# EAGLE design WiLo V1.0 (EAGLE 9.6.2)
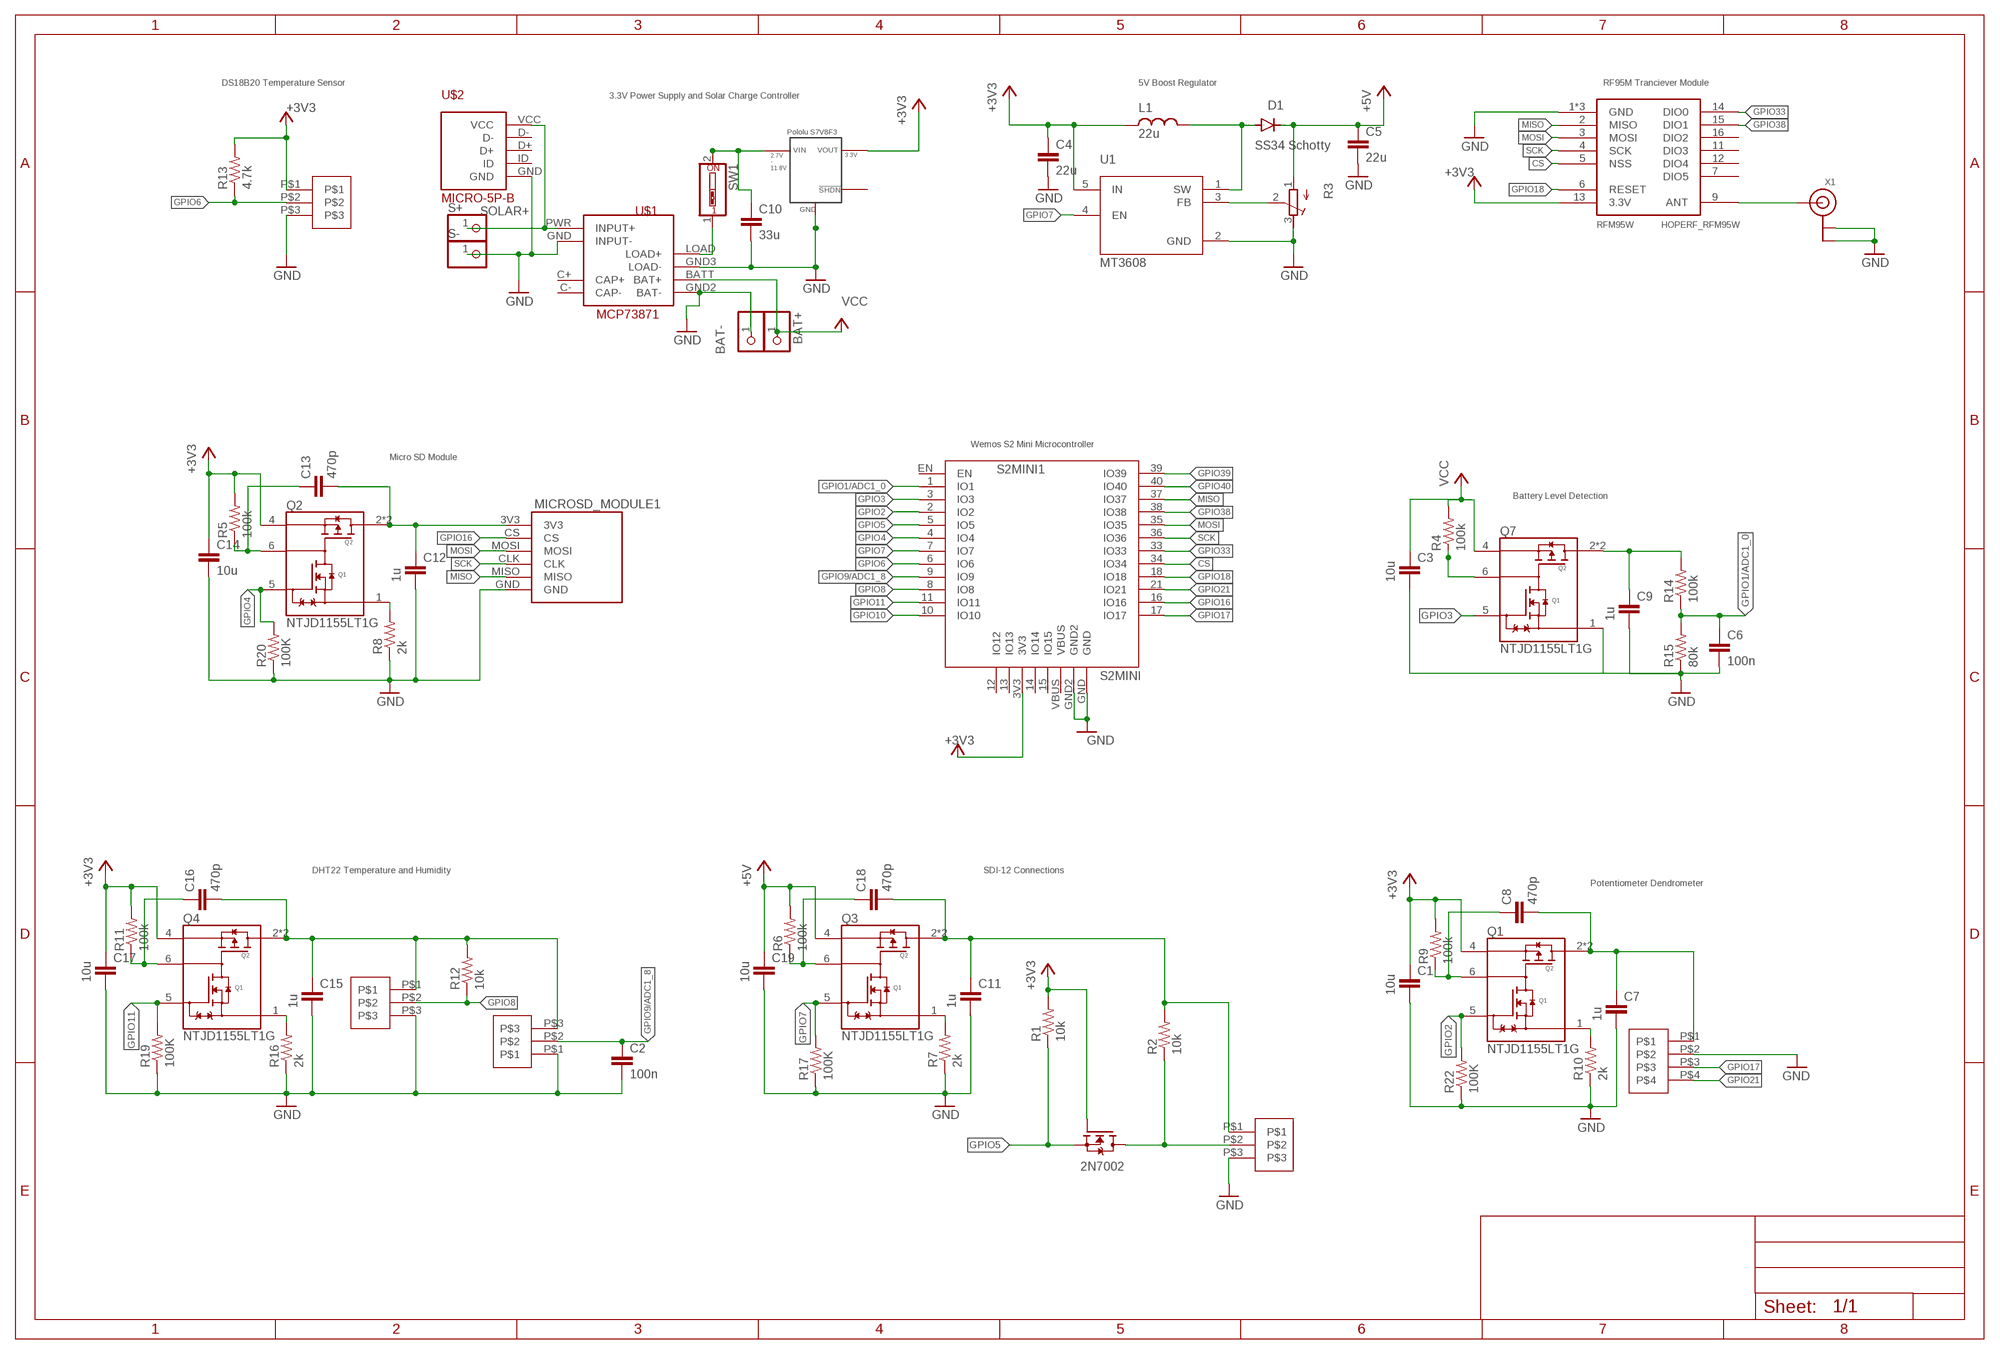
[diagram p0: schematic, sheet 1]

## Parts
BAT+  PINHD-1X1  [1X01]
BAT-  PINHD-1X1  [1X01]
C1  10u  C-EUC0805  [C0805]
C2  100n  C-EUC0805  [C0805]
C3  10u  C-EUC0805  [C0805]
C4  22u  C-EUC0805  [C0805]
C5  22u  C-EUC0805  [C0805]
C6  100n  C-EUC0805  [C0805]
C7  1u  C-EUC0805  [C0805]
C8  470p  C-EUC0805  [C0805]
C9  1u  C-EUC0805  [C0805]
C10  33u  C-EU025-024X044  [C025-024X044]
C11  1u  C-EUC0805  [C0805]
C12  1u  C-EUC0805  [C0805]
C13  470p  C-EUC0805  [C0805]
C14  10u  C-EUC0805  [C0805]
C15  1u  C-EUC0805  [C0805]
C16  470p  C-EUC0805  [C0805]
C17  10u  C-EUC0805  [C0805]
C18  470p  C-EUC0805  [C0805]
C19  10u  C-EUC0805  [C0805]
D1  SS34 Schotty  DIODE-DO214BA  [DO214BA]
L1  22u  LSLF7045  [SLF7045]
MICROSD_MODULE1  GENERIC_MICROSD_MODULE  [GENERIC_MICROSD_MODULE]
Q1  NTJD1155LT1G  [TRANS_NTJD1155LT1G]
Q2  NTJD1155LT1G  [TRANS_NTJD1155LT1G]
Q3  NTJD1155LT1G  [TRANS_NTJD1155LT1G]
Q4  NTJD1155LT1G  [TRANS_NTJD1155LT1G]
Q6  2N7002  [SOT95P240X111-3N]
Q7  NTJD1155LT1G  [TRANS_NTJD1155LT1G]
R1  10k  R-US_R0603  [R0603]
R2  10k  R-US_R0603  [R0603]
R3  R-TRIMM3296W  [RTRIM3296W]
R4  100k  R-US_R0603  [R0603]
R5  100k  R-US_R0603  [R0603]
R6  100k  R-US_R0603  [R0603]
R7  2k  R-US_R0603  [R0603]
R8  2k  R-US_R0603  [R0603]
R9  100k  R-US_R0603  [R0603]
R10  2k  R-US_R0603  [R0603]
R11  100k  R-US_R0603  [R0603]
R12  10k  R-US_R0603  [R0603]
R13  4.7k  R-US_R0603  [R0603]
R14  100k  R-US_R0603  [R0603]
R15  80k  R-US_R0603  [R0603]
R16  2k  R-US_R0603  [R0603]
R17  100K  R-US_R0603  [R0603]
R19  100K  R-US_R0603  [R0603]
R20  100K  R-US_R0603  [R0603]
R22  100K  R-US_R0603  [R0603]
RFM95W  HOPERF_RFM95W  [HOPERF_RFM95W]
S2MINI1  S2MINI  [S2MINI]
S+  PINHD-1X1  [1X01]
S-  PINHD-1X1  [1X01]
SW1  SW_DIP-1  [EDG-01]
U1  MT3608  [SOT95P280X145-6N]
U$1  MCP73871  [MCP73871]
U$2  MICRO-5P-B  [MICRO-5P-B]
U$3  S7V8F3  [S7V8F3]
U$4  3PIN_2.54_SCREW  [3PIN_2.54_SCREW]
U$5  3PIN_2.54_SCREW  [3PIN_2.54_SCREW]
U$6  3PIN_2.54_SCREW  [3PIN_2.54_SCREW]
U$7  3PIN_2.54_SCREW  [3PIN_2.54_SCREW]
U$8  4PIN_2.54_SCREW  [4PIN_2.54_SCREW]
X1  ANTENNA_U.FL  [U.FL]

## Nets
5V_SDI12: C11.1 C18.2 Q3.2(D2) Q3.3(D2) R2.2 U$7.P$1
+3V3: C1.1 C4.1 C14.1 C17.1 L1.+ Q1.4(S2) Q2.4(S2) Q4.4(S2) Q6.1(G) R1.2 R5.2 R9.2 R11.2 R13.2 RFM95W.13(3.3V) S2MINI1.3V3 U1.5(IN) U$3.VOUT U$4.P$1
+5V: C5.1 C19.1 D1.C Q3.4(S2) R3.1(A) R6.2
CS [Impedance]: RFM95W.5(NSS) S2MINI1.34(IO34)
GND: BAT-.1 C1.2 C2.2 C3.2 C4.2 C5.2 C6.2 C7.2 C9.2 C10.2 C11.2 C12.2 C14.2 C15.2 C17.2 C19.2 MICROSD_MODULE1.GND Q7.1(S1) R3.3(E) R7.1 R8.1 R10.1 R15.1 R16.1 R17.1 R19.1 R20.1 R22.1 RFM95W.1(GND) RFM95W.8(GND) RFM95W.10(GND) S2MINI1.GND S2MINI1.GND2 S-.1 U1.2(GND) U$1.GND2(BAT-) U$1.GND3(LOAD-) U$1.GND(INPUT-) U$2.GND U$3.GND U$4.P$3 U$5.P$3 U$6.P$1 U$7.P$3 U$8.P$2 X1.1(GND) X1.2(GND)
GPIO1/ADC1_0 [vcc]: C6.1 R14.1 R15.2 S2MINI1.1(IO1)
GPIO2 [vcc]: Q1.5(G1) R22.2 S2MINI1.2(IO2)
GPIO3 [vcc]: Q7.5(G1) S2MINI1.3(IO3)
GPIO4 [vcc]: Q2.5(G1) R20.2 S2MINI1.4(IO4)
GPIO5 [vcc]: Q6.2(S) R1.1 S2MINI1.5(IO5)
GPIO6 [vcc]: R13.1 S2MINI1.6(IO6) U$4.P$2
GPIO7 [vcc]: Q3.5(G1) R17.2 S2MINI1.7(IO7) U1.4(EN)
GPIO8 [vcc]: R12.1 S2MINI1.8(IO8) U$5.P$2
GPIO9/ADC1_8 [vcc]: C2.1 S2MINI1.9(IO9) U$6.P$2
GPIO10 [vcc]: S2MINI1.10(IO10)
GPIO11 [vcc]: Q4.5(G1) R19.2 S2MINI1.11(IO11)
GPIO16 [vcc]: MICROSD_MODULE1.CS S2MINI1.16(IO16)
GPIO17 [vcc]: S2MINI1.17(IO17) U$8.P$3
GPIO18 [vcc]: RFM95W.6(RESET) S2MINI1.18(IO18)
GPIO21 [vcc]: S2MINI1.21(IO21) U$8.P$4
GPIO33 [vcc]: RFM95W.14(DIO0) S2MINI1.33(IO33)
GPIO38: RFM95W.15(DIO1) S2MINI1.38(IO38)
GPIO39 [vcc]: S2MINI1.39(IO39)
GPIO40: S2MINI1.40(IO40)
MISO [vcc]: MICROSD_MODULE1.MISO RFM95W.2(MISO) S2MINI1.37(IO37)
MOSI [vcc]: MICROSD_MODULE1.MOSI RFM95W.3(MOSI) S2MINI1.35(IO35)
N$1 [Impedance]: RFM95W.9(ANT) X1.3(SIGNAL)
N$2: C18.1 Q3.6(D1/G2) R6.1
N$4: Q3.1(S1) R7.2
N$5: C8.1 Q1.6(D1/G2) R9.1
N$6: C7.1 C8.2 Q1.2(D2) Q1.3(D2) U$8.P$1
N$7: Q1.1(S1) R10.2
N$9: D1.A L1.- U1.1(SW)
N$12: C10.1 SW1.2 U$3.VIN
N$13: C9.1 Q7.2(D2) Q7.3(D2) R14.2
N$14: R3.2(S) U1.3(FB)
N$15: C13.1 Q2.6(D1/G2) R5.1
N$16: C12.1 C13.2 MICROSD_MODULE1.3V3 Q2.2(D2) Q2.3(D2)
N$17: Q2.1(S1) R8.2
N$18: Q7.6(D1/G2) R4.1
N$19: C16.1 Q4.6(D1/G2) R11.1
N$21: C15.1 C16.2 Q4.2(D2) Q4.3(D2) R12.2 U$5.P$1 U$6.P$3
N$22: Q4.1(S1) R16.2
N$24: Q6.3(D) R2.1 U$7.P$2
N$130: SW1.1 U$1.LOAD(LOAD+)
SCK [vcc]: MICROSD_MODULE1.CLK RFM95W.4(SCK) S2MINI1.36(IO36)
SOLAR+ [vcc]: S+.1 U$1.PWR(INPUT+) U$2.VCC
VCC [vcc]: BAT+.1 C3.1 Q7.4(S2) R4.2 U$1.BATT(BAT+)
Unconnected: RFM95W.7(DIO5) RFM95W.11(DIO3) RFM95W.12(DIO4) RFM95W.16(DIO2) S2MINI1.12(IO12) S2MINI1.13(IO13) S2MINI1.14(IO14) S2MINI1.15(IO15) S2MINI1.EN S2MINI1.VBUS U$1.C+(CAP+) U$1.C-(CAP-) U$2.D+ U$2.D- U$2.ID U$3.!SHDN

## Notes on the sheet
- DS18B20 Temperature Sensor | 5V Boost Regulator | RF95M Tranciever Module
- 3.3V Power Supply and Solar Charge Controller
- Wemos S2 Mini Microcontroller
- Micro SD Module
- Battery Level Detection
- DHT22 Temperature and Humidity | SDI-12 Connections
- Potentiometer Dendrometer

## Library data of the parts
BAT+ BAT- S+ S- = pinhead:PINHD-1X1: PIN HEADER
C1-C19 = rcl:C-EU: CAPACITOR, European symbol; SPICEPREFIX: C
D1 = diode:DIODE-: DIODE
L1 = ELL6UH220:L: INDUCTOR
MICROSD_MODULE1 = GENERIC_MICROSD_MODULE:GENERIC_MICROSD_MODULE
Q1-Q4 Q7 = NTJD1155LT1G:NTJD1155LT1G: Mosfet Array N and P-Channel 8V 1.3A 400mW Surface Mount SC-88/SC70-6/SOT-363 Check availability <https://pricing.snapeda.com/parts/NTJD1155LT1G/ON%20Semiconductor/view-part?ref=eda>; AVAILABILITY: In Stock; CHECK_PRICES: https://www.snapeda.com/parts/NTJD1155LT1G/Onsemi/view-part/?ref=eda; DESCRIPTION: Mosfet Array N and P-Channel 8V 1.3A 400mW Surface Mount SC-88/SC70-6/SOT-363; MF: ON Semiconductor; MP: NTJD1155LT1G; PACKAGE: SC-88-6 ON Semiconductor; PRICE: None; SNAPEDA_LINK: https://www.snapeda.com/parts/NTJD1155LT1G/Onsemi/view-part/?ref=snap
Q6 = 2N7002:2N7002: N-Channel 60V 280mA (Ta) 350mW (Ta) Surface Mount SOT-23-3 (TO-236) Check availability <https://pricing.snapeda.com/parts/2N7002/ON%20Semiconductor/view-part?ref=eda>; AVAILABILITY: In Stock; CHECK_PRICES: https://www.snapeda.com/parts/2N7002/Onsemi/view-part/?ref=eda; DESCRIPTION: Mosfet Array 2 N-Channel (Dual) 60V 280mA 250mW Surface Mount SOT-563F; MF: ON Semiconductor; MP: 2N7002; PACKAGE: SOT-23-3 ON Semiconductor; PRICE: None; SNAPEDA_LINK: https://www.snapeda.com/parts/2N7002/Onsemi/view-part/?ref=snap
R1 R2 R4-R17 R19 R20 R22 = rcl:R-US_: RESISTOR, American symbol; SPICEPREFIX: R
R3 = rcl:R-TRIMM: Trimm resistor; SPICEMODEL: X; SPICEPREFIXL: POT
RFM95W = lora-lorawan-modules:HOPERF_RFM95W: HopeRF LoRaWAN modules Link: http://www.hoperf.com/rf_transceiver/lora/; HEIGHT: 1.8; LENGTH: 16; WIDTH: 16
S2MINI1 = S2MINI:S2MINI
SW1 = special:SW_DIP-1: DIP SWITCH
U1 = MT3608:MT3608: High Efficiency 1.2MHz 2A Step Up Converter Check availability <https://pricing.snapeda.com/parts/MT3608/Aerosemi%20Technology%20Co.%2C%20Ltd/view-part?ref=eda>; AVAILABILITY: Not in stock; CHECK_PRICES: https://www.snapeda.com/parts/MT3608/Aerosemi+Technology+Co.%252C+Ltd/view-part/?ref=eda; DESCRIPTION: High Efficiency 1.2MHz 2A Step Up Converter; MF: Aerosemi Technology Co., Ltd; MP: MT3608; PACKAGE: Package; PRICE: None; SNAPEDA_LINK: https://www.snapeda.com/parts/MT3608/Aerosemi+Technology+Co.%252C+Ltd/view-part/?ref=snap
U$1 = MCP73871 Solar Battery Charging Board:MCP73871
U$2 = MICRO-5P-B:MICRO-5P-B
U$3 = Pololu_S7V8F3:S7V8F3: Pololu S7V8F3 - Pololu 3.3V Step-Up/Step-Down Voltage Regulator S7V8F3 - The S7V8F3 switching step-up/step-down regulator efficiently produces a fixed 3.3 V output from input voltages between 2.7 V and 11.8 V. Its ability to convert both higher and lower input voltages makes it useful for applications where the power supply voltage can vary greatly, as with batteries that start above but discharge below the regulated voltage. The compact module has a typical efficiency of over 90% and can deliver 500 mA to 1 A across most of the input voltage range.
U$4-U$7 = 3-PIN_2.54_SCREW:3PIN_2.54_SCREW
U$8 = 4-PIN_2.54_SCREW:4PIN_2.54_SCREW
X1 = adafruit:ANTENNA_U.FL: U.FL Antenna Connector

## Net classes
0 default: width 0.203 mm
1 vcc: width 0.254 mm
2 Impedance: clearance 0.254 mm

## Board
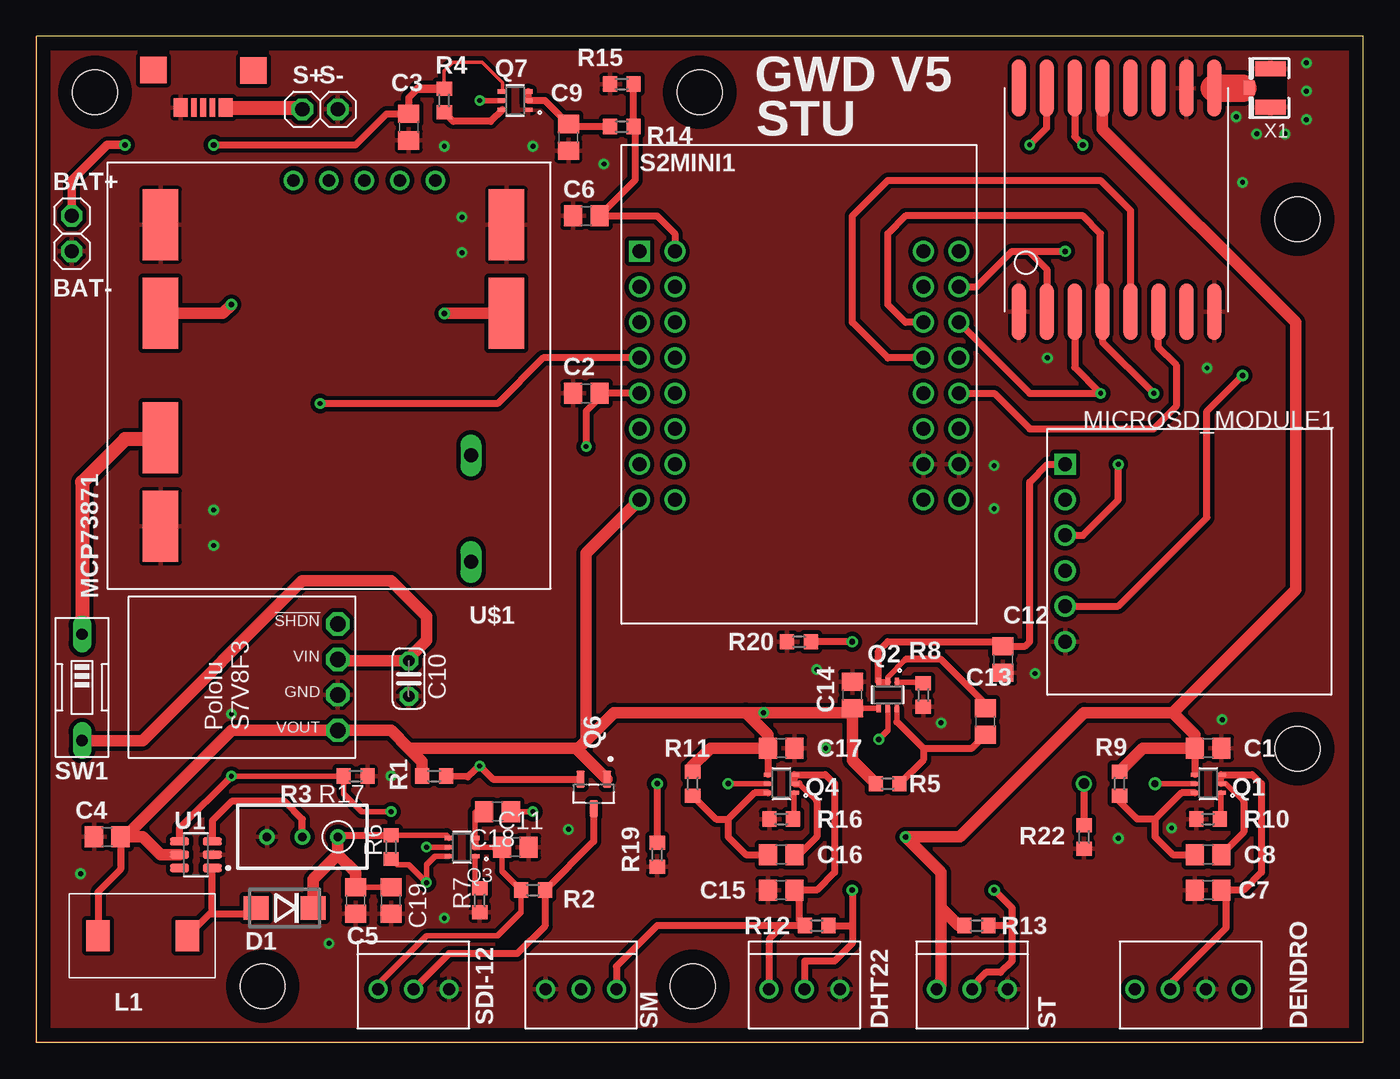
[diagram p1: board, top side]
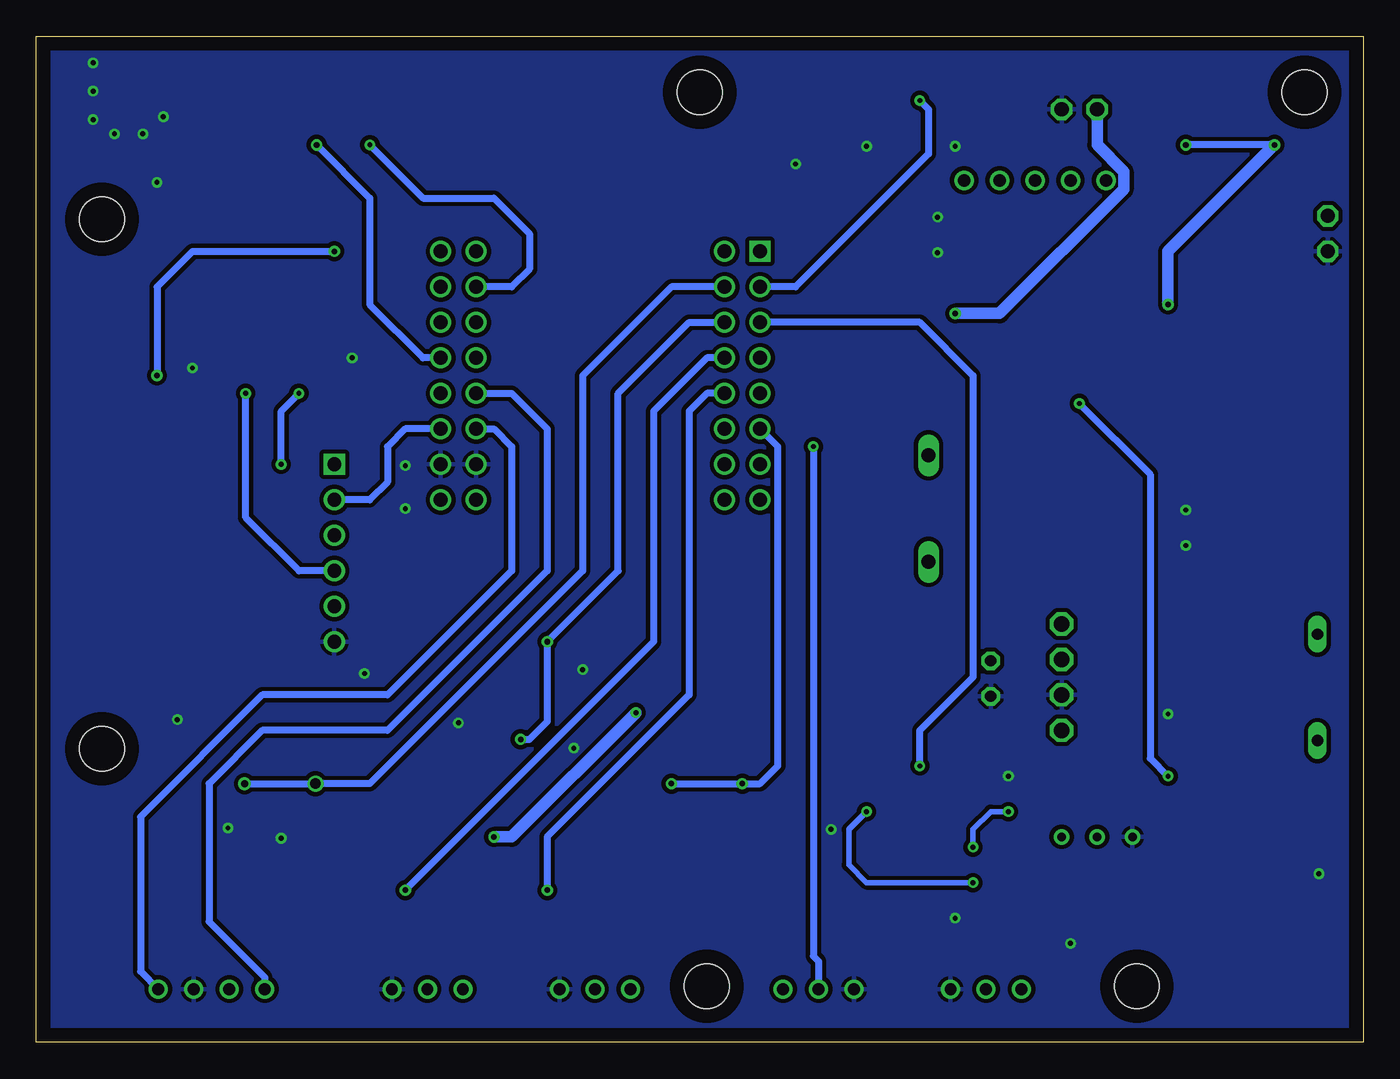
[diagram p2: board, bottom side, seen from below]

Size 95 x 72 mm. Coordinates in mm from the lower left corner, seen from the top.
Outline: 0,0 95,0 95,72 0,72 0,0
Copper layers (1*16): Top 0.035mm / dielectric 1.5mm / Bottom 0.035mm
Design rules "default": minimum track width 6mil, minimum drill 0.35mm, track to track 6mil, track to pad 6mil, pad to pad 6mil, via to via 6mil, smd to smd 6mil, copper to edge 40mil, drill to drill 6mil, minimum pad ring 10mil, minimum via ring 8mil, stop-mask expansion 4mil, vias tented up to drill 0mil, thermal gap 10mil
Holes 3.2 mm at 47,4 47.5,68 90.3,58.9 4.2,68 90.3,21 16.2,4
tKeepout: area 45.3,2.3 to 48.7,5.7; area 45.8,66.3 to 49.2,69.7; area 88.6,57.2 to 92,60.6; area 2.5,66.3 to 5.9,69.7; area 88.6,19.3 to 92,22.7; area 14.5,2.3 to 17.9,5.7
bKeepout: area 45.3,2.3 to 48.7,5.7; area 45.3,2.3 to 48.7,5.7; area 45.8,66.3 to 49.2,69.7; area 45.8,66.3 to 49.2,69.7; area 88.6,57.2 to 92,60.6; area 88.6,57.2 to 92,60.6; area 2.5,66.3 to 5.9,69.7; area 2.5,66.3 to 5.9,69.7; area 88.6,19.3 to 92,22.7; area 88.6,19.3 to 92,22.7; area 14.5,2.3 to 17.9,5.7; area 14.5,2.3 to 17.9,5.7
tRestrict: area 45.3,2.3 to 48.7,5.7; area 45.8,66.3 to 49.2,69.7; area 88.6,57.2 to 92,60.6; area 2.5,66.3 to 5.9,69.7; area 88.6,19.3 to 92,22.7; area 14.5,2.3 to 17.9,5.7
vRestrict: area 45.3,2.3 to 48.7,5.7; area 45.8,66.3 to 49.2,69.7; area 88.6,57.2 to 92,60.6; area 2.5,66.3 to 5.9,69.7; area 88.6,19.3 to 92,22.7; area 14.5,2.3 to 17.9,5.7

### Footprints (pad centres in the part's own frame; a part is rotated, then mirrored left to right if it is on the bottom)
1X01 = drill 1.016 octagon: 1 0,0
C0805 = smd 1.3 x 1.5: 1 -0.95,0; 2 0.95,0
C025-024X044 = drill 0.813 octagon: 1 -1.27,0; 2 1.27,0
DO214BA = smd 1.8 x 1.7: A 2.05,0; C -2.05,0
SLF7045 = smd 1.7 x 2.2: + -3.2,0; - 3.2,0
GENERIC_MICROSD_MODULE = drill 1 square: 3V3 1.27,-2.54 | drill 1: CLK 1.27,-10.16; CS 1.27,-5.08; GND 1.27,-15.24; MISO 1.27,-12.7; MOSI 1.27,-7.62
TRANS_NTJD1155LT1G = smd 0.66 x 0.3: 1 -0.92,0.65; 2 -0.92,0; 3 -0.92,-0.65; 4 0.92,-0.65; 5 0.92,0; 6 0.92,0.65
SOT95P240X111-3N = smd 1.23 x 0.6: 1 -1.06,0.95; 2 -1.06,-0.95; 3 1.06,0
R0603 = smd 1 x 1.1: 1 -0.85,0; 2 0.85,0
RTRIM3296W = drill 0.61: 1 0,-2.54; 2 0,0; 3 0,2.54
HOPERF_RFM95W = smd 4.064 x 1.016: 1 -8.12,7.13; 2 -8.12,5.13; 3 -8.12,3.13; 4 -8.12,1.13; 5 -8.12,-0.87; 6 -8.12,-2.87; 7 -8.12,-4.87; 8 -8.12,-6.87; 9 7.88,-6.87; 10 7.88,-4.87; 11 7.88,-2.87; 12 7.88,-0.87; 13 7.88,1.13; 14 7.88,3.13; 15 7.88,5.13; 16 7.88,7.13
S2MINI = drill 1: 1 3.81,-7.62; 2 3.81,-10.16; 3 1.27,-10.16; 3V3 1.27,-25.4; 4 3.81,-12.7; 5 1.27,-12.7; 6 3.81,-15.24; 7 1.27,-15.24; 8 3.81,-17.78; 9 1.27,-17.78; 10 3.81,-20.32; 11 1.27,-20.32; 12 1.27,-22.86; 13 3.81,-22.86; 14 3.81,-25.4; 15 21.59,-25.4; 16 24.13,-20.32; 17 21.59,-20.32; 18 24.13,-17.78; 21 21.59,-17.78; 33 24.13,-15.24; 34 21.59,-15.24; 35 24.13,-12.7; 36 21.59,-12.7; 37 24.13,-10.16; 38 21.59,-10.16; 39 24.13,-7.62; 40 21.59,-7.62; GND 21.59,-22.86; GND2 24.13,-22.86; VBUS 24.13,-25.4 | drill 1 square: EN 1.27,-7.62
EDG-01 = drill 0.813 long: 1 0,-3.81; 2 0,3.81
SOT95P280X145-6N = smd 1.37 x 0.59: 1 -1.17,0.95; 2 -1.17,0; 3 -1.17,-0.95; 4 1.17,-0.95; 5 1.17,0; 6 1.17,0.95
MCP73871 = drill 0.9: + 8.255,1.27; +2 15.875,1.27; - 10.795,1.27; C 18.415,1.27; D 13.335,1.27 | smd 2.54 x 5.08: BATT 27.94,10.795; GND 3.175,4.445; GND2 27.94,4.445; GND3 27.94,26.035; LOAD 27.94,19.685; PWR 3.175,10.795 | drill 1 long: C+ 5.715,20.955; C- 5.715,28.575
MICRO-5P-B = smd 0.4 x 1.35: D+ 0,2.7; D- -0.65,2.7; ID 0.65,2.7 | smd 1 x 1.35: GND 1.6,2.7; VCC -1.6,2.7 | smd 1.9 x 1.9: P$1 3.55,0; P$8 -3.6,0.05
S7V8F3 = drill 1.1 octagon: !SHDN 3.81,0; GND -1.27,0; VIN 1.27,0; VOUT -3.81,0
3PIN_2.54_SCREW = drill 0.85: P$1 2.8,6.54; P$2 2.8,4; P$3 2.8,1.46
4PIN_2.54_SCREW = drill 0.85: P$1 2.8,6.54; P$2 2.8,4; P$3 2.8,1.46; P$4 2.8,9.08
U.FL = smd 2.2 x 1.05: 1 0,1.375; 2 0,-1.375 | smd 0.8 x 1: 3 1.525,0

### Placement (x,y rotation side)
BAT+  2.54,59.15 0 top
BAT-  2.54,56.61 0 top
C1  83.9,21.05 0 top
C2  39.37,46.45 180 top
C3  26.67,65.5 270 top
C4  5.08,14.7 180 top
C5  22.86,10.16 270 top
C6  39.37,59.15 180 top
C7  83.9,10.89 180 top
C8  83.9,13.43 0 top
C9  38.1,64.77 270 top
C10  26.67,26.04 270 top
C11  34.29,13.97 0 top
C12  69.22,27.4 270 top
C13  67.94,22.95 90 top
C14  58.42,24.86 90 top
C15  53.34,10.89 180 top
C16  53.34,13.43 0 top
C17  53.34,21.05 0 top
C18  33.02,16.51 180 top
C19  25.4,10.16 270 top
D1  17.78,9.62 180 top
L1  7.62,7.62 0 top
MICROSD_MODULE1  72.39,43.91 0 top
Q1  83.9,18.51 180 top
Q2  60.96,24.86 270 top
Q3  30.48,13.97 180 top
Q4  53.34,18.51 180 top
Q6  39.91,17.78 270 top
Q7  34.29,67.41 180 top
R1  28.48,19.05 180 top
R2  35.56,10.89 180 top
R3  19.05,14.7 90 top
R4  29.21,67.41 90 top
R5  60.96,18.51 180 top
R6  25.4,13.97 90 top
R7  31.75,10.16 90 top
R8  63.5,24.86 90 top
R9  77.55,18.51 90 top
R10  83.9,15.97 0 top
R11  46.99,18.51 90 top
R12  55.88,8.35 180 top
R13  67.31,8.35 180 top
R14  41.91,65.54 180 top
R15  41.91,68.58 0 top
R16  53.34,15.97 0 top
R17  22.86,19.05 180 top
R19  44.45,13.43 90 top
R20  54.61,28.67 0 top
R22  75.01,14.7 90 top
RFM95W  77.47,60.42 90 top
S2MINI1  41.91,64.23 0 top
S+  19.05,66.77 0 top
S-  21.59,66.77 0 top
SW1  3.27,25.4 180 top
U1  11.43,13.43 180 top
U$1  36.83,62.96 180 top
U$2  11.95,69.6 180 top
U$3  21.59,26.13 90 top
U$4  71,1 90 top
U$5  59,1 90 top
U$6  43,1 90 top
U$7  31,1 90 top
U$8  87.73,1 90 top
X1  88.37,68.3 180 top

### Tracks (layer width: path | path; a pad name or v marks a point on that pad's centre or on a via)
5V_SDI12
  Top 0.406: Q3.3 31.4,16.48 C18.2 | Q3.2 C11.1 33.34,12.26 R2.2 34.71,9.31 33.02,7.62 27.94,7.62 24.46,4.14 U$7.P$1
  Top 0.508: Q3.3 Q3.2
+3V3  (via drill 0.35, 0.4)
  Top 0.406: C14.1 60.28,23.91 Q2.4
  Top 0.508: C1.1 82.95,19.19 Q1.4 | Q4.4 52.42,21.02 C17.1 | C4.1 6.03,12.38 4.42,10.77 L1.+
  Top 0.813: S2MINI1.3V3 39.37,35.02 39.37,21.59 | U1.5 8.89,13.43 7.62,14.7 C4.1 6.35,14.7 13.97,22.32 U$3.VOUT 25.4,22.32 26.67,21.05 | R11.2 46.89,19.46 46.89,19.68 48.26,21.05 C17.1 52.39,22 50.8,23.59 | R9.2 79.24,21.05 C1.1 82.95,22 81.36,23.59 | R5.2 58.42,20.2 C14.1 58.1,23.59 v52.07,23.59 50.8,23.59 | 81.36,23.59 75.01,23.59 66.12,14.7 v62.23,14.7 64.77,12.16 64.77,9.62 | 81.36,23.59 90.17,32.4 90.17,51.53 76.34,65.36 RFM95W.13 | 64.77,9.62 66.04,8.35 R13.2 | U$4.P$1 64.77,4.11 64.77,9.62 | 26.67,21.05 38.64,21.05 | Q6.1 38.64,21.05 | 38.64,21.05 38.83,21.05 39.37,21.59 | 50.8,23.59 41.37,23.59 39.37,21.59 | 26.67,21.05 27.63,20.09 R1.2
  Bottom 0.813: v62.23,14.7 60.96,14.7 v52.07,23.59
+5V
  Top 0.406: R6.2 29.36,14.82 Q3.4 | C5.1 C19.1
  Top 0.508: R3.1 21.71,14.82 R6.2
  Top 0.813: R3.1 21.59,13.43 | D1.C 19.83,11.67 21.59,13.43 | 21.59,13.43 22.86,12.16 C5.1
CS
  Top 0.508: S2MINI1.34 60.96,48.99 58.42,51.53 58.42,59.15 60.96,61.69 76.2,61.69 78.34,59.55 RFM95W.5
GND  (via drill 0.35)
  other vias: 81.28,15.34 56.52,21.05 20.95,7.08 68.58,38.2 72.39,48.99 90.93,66.04 86.37,61.55 90.93,70.1 90.93,68.07 85.91,66.25 87.38,65.02 89.41,65.02 84.9,23.1 64.77,22.86 55.88,26.67 3.17,12.06 71.5,26.4 77.47,14.61 68.58,41.27 12.7,38.1 12.7,35.56 30.48,59.05 29.21,64.14 35.56,64.14 40.64,62.87 30.48,56.52 13.97,23.5 83.82,48.26 38.1,15.24 29.21,8.89 25.4,19.05
  pour Top (isolate 0.305): 0,72 95,72 95,0 0,0
  pour Bottom (isolate 0.305): 0,72 95,72 95,0 0,0
GPIO1/ADC1_0
  Top 0.508: R15.2 R14.1 42.86,65.44 42.86,61.69 C6.1 44.45,59.15 45.72,57.88 S2MINI1.1
GPIO2  (via drill 0.5, 0.75)
  Top 0.406: Q1.5 v80.09,18.51
  Top 0.508: v75.01,18.51 R22.2
  Bottom 0.508: v80.09,18.51 v75.01,18.51 71.12,18.51 55.88,33.75 55.88,47.72 49.53,54.07 S2MINI1.2
GPIO3  (via drill 0.35)
  Top 0.406: Q7.5 v31.75,67.41
  Bottom 0.508: v31.75,67.41 31.11,66.77 31.11,63.59 40.64,54.07 S2MINI1.3
GPIO4  (via drill 0.4)
  Top 0.406: Q2.5 60.96,22.32 v60.33,21.68
  Top 0.508: v58.42,28.67 R20.2
  Bottom 0.508: v60.33,21.68 59.69,21.68 58.42,22.95 v58.42,28.67 53.34,33.75 53.34,46.45 48.26,51.53 S2MINI1.4
GPIO5  (via drill 0.35)
  Top 0.508: R1.1 30.88,19 v31.75,19.78 32.69,18.84 Q6.2
  Bottom 0.508: v31.75,19.78 31.75,22.32 27.94,26.13 27.94,47.72 31.75,51.53 S2MINI1.5
GPIO6  (via drill 0.4)
  Top 0.508: v68.58,10.89 69.85,9.62 69.85,8.35 | 69.85,8.35 69.85,5.81 69.04,5 68,5 66.9,3.9 U$4.P$2 | 69.85,8.35 R13.1
  Bottom 0.508: S2MINI1.6 46.99,48.99 50.8,45.18 50.8,28.67 v68.58,10.89
GPIO7  (via drill 0.35)
  Top 0.406: v13.97,19.05 R17.2 22.01,17.78 23.28,16.51 v25.4,16.51 | v27.94,13.97 Q3.5
  Top 0.508: U1.4 10.26,15.34 v13.97,19.05 | S2MINI1.7 36.29,48.99 33.02,45.72 v20.32,45.72
  Bottom 0.406: v25.4,16.51 26.67,16.51 27.94,15.24 v27.94,13.97
  Bottom 0.508: v20.32,45.72 15.24,40.64 15.24,20.32 v13.97,19.05
GPIO8  (via drill 0.4)
  Top 0.508: 58.42,8.35 58.42,7.08 57.15,5.81 55,5.81 U$5.P$2 | R12.1 58.42,8.35 | v58.42,10.89 58.42,8.35
  Bottom 0.508: S2MINI1.8 46.99,46.45 48.26,45.18 48.26,24.86 58.42,14.7 v58.42,10.89
GPIO9/ADC1_8  (via drill 0.35)
  Top 0.508: S2MINI1.9 C2.1 40.32,46.13 39.37,45.18 v39.37,42.64
  Bottom 0.508: v39.37,42.64 39.37,6.17 39,5.8 U$6.P$2
GPIO11  (via drill 0.4)
  Top 0.406: Q4.5 v49.53,18.51
  Top 0.508: v44.45,18.51 R19.2
  Bottom 0.508: S2MINI1.11 41.91,42.64 41.91,19.78 43.18,18.51 v44.45,18.51 v49.53,18.51
GPIO16
  Bottom 0.508: S2MINI1.16 68.58,43.91 69.85,42.64 69.85,40.1 71.12,38.83 MICROSD_MODULE1.CS
GPIO17
  Bottom 0.508: S2MINI1.17 62.23,43.91 60.96,42.64 60.96,33.75 69.85,24.86 78.82,24.86 87.54,16.14 87.54,5.07 U$8.P$3
GPIO18
  Top 0.508: S2MINI1.18 68.58,46.45 71.12,43.91 80.01,43.91 81.61,45.51 81.61,48.49 80.34,49.76 RFM95W.6
GPIO21
  Bottom 0.508: S2MINI1.21 60.96,46.45 58.42,43.91 58.42,33.75 69.85,22.32 78.82,22.32 82.63,18.51 82.63,8.63 78.65,4.65 U$8.P$4
GPIO33  (via drill 0.4)
  Top 0.508: v74.93,64.23 74.34,64.82 RFM95W.14
  Bottom 0.508: v74.93,64.23 71.12,60.42 71.12,52.8 67.31,48.99 S2MINI1.33
GPIO38  (via drill 0.35)
  Top 0.508: RFM95W.15 72.34,65.45 v71.12,64.23
  Bottom 0.508: v71.12,64.23 67.31,60.42 62.23,60.42 59.69,57.88 59.69,55.34 60.96,54.07 S2MINI1.38
MISO  (via drill 0.4)
  Top 0.508: 71.07,56.61 72.34,55.34 RFM95W.2 | S2MINI1.37 67.31,54.07 69.85,56.61 71.07,56.61 | MICROSD_MODULE1.MISO 77.47,31.21 83.82,37.56 83.82,45.18 v86.36,47.72 | 71.07,56.61 v73.66,56.61
  Bottom 0.508: v86.36,47.72 86.36,54.07 83.82,56.61 v73.66,56.61
MOSI  (via drill 0.35)
  Top 0.508: S2MINI1.35 71.12,46.45 v76.2,46.45 74.34,48.31 RFM95W.3 | MICROSD_MODULE1.MOSI 74.93,36.29 77.47,38.83 v77.47,41.37
  Bottom 0.508: v77.47,41.37 77.47,45.18 v76.2,46.45
N$1
  Top 0.508: X1.3 86.37,68.3
  Top 1.956: 86.37,68.3 RFM95W.9
N$2  (via drill 0.35)
  Top 0.406: C18.1 v35.56,16.51 | R6.1 25.82,12.7 26.67,12.7 v27.94,11.43 27.94,12.7 28.56,13.32 Q3.6
  Bottom 0.406: v27.94,11.43 35.56,11.43 36.83,12.7 36.83,15.24 v35.56,16.51
N$4
  Top 0.406: Q3.1 31.4,11.36 R7.2
N$5
  Top 0.508: Q1.6 81.98,17.86 80.09,15.97 | 80.09,15.97 80.09,14.7 81.36,13.43 C8.1 | R9.1 77.55,17.24 78.82,15.97 80.09,15.97
N$6
  Top 0.406: Q1.2 85.17,18.51 86.44,17.24
  Top 0.508: 86.44,17.24 86.44,15.02 C8.2 | Q1.2 Q1.3 87.06,19.16 87.71,18.51 87.71,12.16 86.44,10.89 C7.1 85.17,10.57 85.17,8.17 81.19,4.19 U$8.P$1
N$7
  Top 0.406: Q1.1 84.82,16.04
  Top 0.508: 84.82,16.04 R10.2
N$9
  Top 0.508: L1.- 12.39,9.2 | 12.39,9.2 12.6,9.4 U1.1 | 12.39,9.2 15.3,9.2 D1.A
N$12
  Top 0.813: SW1.2 7.62,21.59 19.05,33.02 25.4,33.02 27.94,30.48 27.94,28.77 26.57,27.4 C10.1 21.68,27.3 U$3.VIN
N$13
  Top 0.508: Q7.3 Q7.2 36.41,67.41 C9.1 38.28,65.54 R14.2
N$14
  Top 0.508: R3.2 19.05,15.97 17.78,17.24 13.97,17.24 12.6,15.87 U1.3
N$15
  Top 0.406: Q2.6 61.61,22.94
  Top 0.508: 63.5,21.05 63.5,20.2 R5.1 | 61.61,22.94 63.5,21.05 | 63.5,21.05 66.99,21.05 C13.1
N$16
  Top 0.406: Q2.2 60.96,26.13 62.23,27.4
  Top 0.508: C13.2 67.94,24.23 64.77,27.4 62.23,27.4 | MICROSD_MODULE1.3V3 72.39,41.37 71.12,40.1 71.12,28.67 70.8,28.35 C12.1 68.89,28.67 60.96,28.67 60.31,28.02 Q2.3 Q2.2
N$17
  Top 0.406: Q2.1 63.43,25.78
  Top 0.508: 63.43,25.78 R8.2
N$18
  Top 0.508: Q7.6 32.53,65.92 29.84,65.92 R4.1
N$19
  Top 0.508: Q4.6 51.42,17.86 49.53,15.97 | 49.53,15.97 49.53,14.7 50.8,13.43 C16.1 | R11.1 48.68,15.97 49.53,15.97
N$21
  Top 0.406: 54.61,18.51 55.88,17.24
  Top 0.508: 54.61,18.51 Q4.2 Q4.3 56.5,19.16 57.15,18.51 57.15,12.16 55.88,10.89 C15.1 54.61,10.57 54.61,8.77 R12.2 53.34,8.35 | 55.88,17.24 55.88,14.7 54.61,13.43 C16.2 | U$6.P$3 41.54,5.44 44.45,8.35 53.34,8.35 | 53.34,8.35 53.34,8.26 52.46,7.38 U$5.P$1
N$22
  Top 0.406: Q4.1 54.26,16.04
  Top 0.508: 54.26,16.04 R16.2
N$24
  Top 0.508: U$7.P$2 29.54,6.34 34.43,6.34 36.41,8.32 R2.1 39.91,14.39 Q6.3
N$130
  Top 1.016: U$1.LOAD 8.79,43.18 6.35,43.18 3.27,40.1 SW1.1
SCK  (via drill 0.35)
  Top 0.508: S2MINI1.36 62.23,51.53 60.96,52.8 60.96,57.88 62.23,59.15 74.93,59.15 76.2,57.88 76.2,52.44 RFM95W.4 76.34,50.12 v80.01,46.45
  Bottom 0.508: MICROSD_MODULE1.CLK 76.2,33.75 80.01,37.56 v80.01,46.45
SOLAR+  (via drill 0.4)
  Top 0.813: v29.21,52.16 U$1.PWR
  Top 1.016: U$2.VCC 18.92,66.9 S+.1
  Bottom 0.813: v29.21,52.16 26.04,52.16 17.14,61.05 17.14,62.33 19.05,64.23 S+.1
VCC  (via drill 0.4)
  Top 0.254: R4.2 29.21,69.53 29.84,70.16 31.9,70.16 33.37,68.69 Q7.4
  Top 0.508: v12.7,64.23 22.86,64.23 25.08,66.45 C3.1 26.67,67.62 27.3,68.25
  Top 0.61: BAT+.1 2.54,61.69 5.08,64.23 v6.35,64.23 | 27.3,68.25 R4.2
  Top 0.813: v13.97,52.8 13.34,52.16 U$1.BATT
  Bottom 0.508: v6.35,64.23 v12.7,64.23
  Bottom 0.813: v6.35,64.23 13.97,56.61 v13.97,52.8
(copper drawn outside any net)
  shapes: Top area x2

### Text on the board
tNames: GWD V5 | STU | L1 | SDI-12 | SM | DHT22 | ST | DENDRO | SDA = GPIO17 = BLUE / SCL = GPIO21 = YELLOW / GND = BLACK